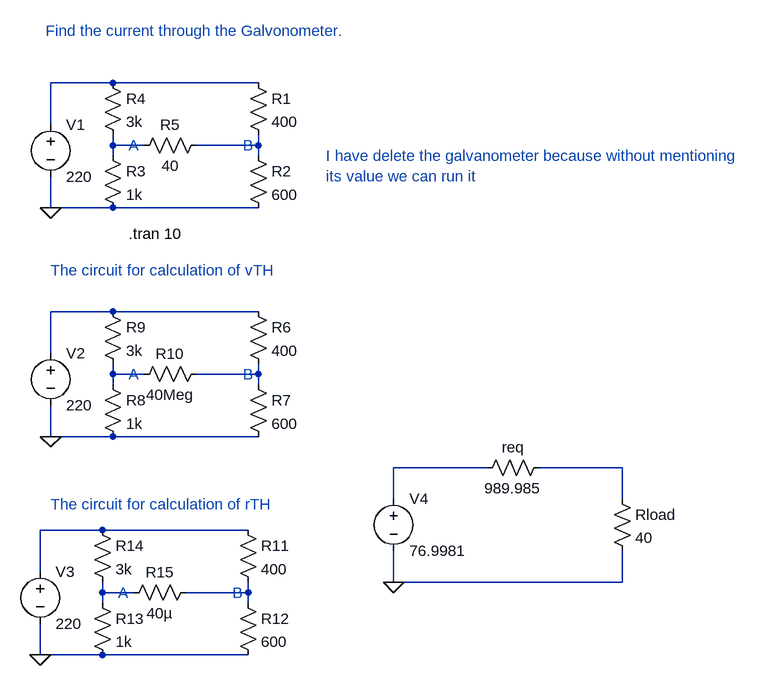
[diagram p0: schematic Lab2_ques2.asc]
Lab2_ques2.asc, the LTspice schematic file:
Version 4
SHEET 1 1068 1392
WIRE 96 160 0 160
WIRE 320 160 96 160
WIRE 0 224 0 160
WIRE 96 256 96 240
WIRE 144 256 96 256
WIRE 320 256 320 240
WIRE 320 256 224 256
WIRE 96 272 96 256
WIRE 320 272 320 256
WIRE 0 352 0 304
WIRE 96 352 0 352
WIRE 320 352 96 352
WIRE 96 512 0 512
WIRE 320 512 96 512
WIRE 0 576 0 512
WIRE 96 608 96 592
WIRE 144 608 96 608
WIRE 320 608 320 592
WIRE 320 608 224 608
WIRE 96 624 96 608
WIRE 320 624 320 608
WIRE 0 704 0 656
WIRE 96 704 0 704
WIRE 320 704 96 704
WIRE 672 752 528 752
WIRE 880 752 752 752
WIRE 528 800 528 752
WIRE 880 800 880 752
WIRE 80 848 -16 848
WIRE 304 848 80 848
WIRE -16 912 -16 848
WIRE 528 928 528 880
WIRE 880 928 880 880
WIRE 880 928 528 928
WIRE 80 944 80 928
WIRE 128 944 80 944
WIRE 304 944 304 928
WIRE 304 944 208 944
WIRE 80 960 80 944
WIRE 304 960 304 944
WIRE -16 1040 -16 992
WIRE 80 1040 -16 1040
WIRE 304 1040 80 1040
FLAG 0 352 0
FLAG 0 704 0
FLAG -16 1040 0
FLAG 528 928 0
SYMBOL Res 304 144 R0
SYMATTR InstName R1
SYMATTR Value 400
SYMBOL Res 304 256 R0
SYMATTR InstName R2
SYMATTR Value 600
SYMBOL Res 80 256 R0
SYMATTR InstName R3
SYMATTR Value 1k
SYMBOL Res 80 144 R0
SYMATTR InstName R4
SYMATTR Value 3k
SYMBOL Voltage 0 208 R0
SYMATTR InstName V1
SYMATTR Value 220
SYMBOL Res 240 240 R90
WINDOW 0 0 56 VBottom 2
WINDOW 3 32 56 VTop 2
SYMATTR InstName R5
SYMATTR Value 40
SYMBOL Res 304 496 R0
SYMATTR InstName R6
SYMATTR Value 400
SYMBOL Res 304 608 R0
SYMATTR InstName R7
SYMATTR Value 600
SYMBOL Res 80 608 R0
SYMATTR InstName R8
SYMATTR Value 1k
SYMBOL Res 80 496 R0
SYMATTR InstName R9
SYMATTR Value 3k
SYMBOL Voltage 0 560 R0
SYMATTR InstName V2
SYMATTR Value 220
SYMBOL Res 240 592 R90
WINDOW 0 0 56 VBottom 2
WINDOW 3 32 56 VTop 2
SYMATTR InstName R10
SYMATTR Value 40Meg
SYMBOL Res 288 832 R0
SYMATTR InstName R11
SYMATTR Value 400
SYMBOL Res 288 944 R0
SYMATTR InstName R12
SYMATTR Value 600
SYMBOL Res 64 944 R0
SYMATTR InstName R13
SYMATTR Value 1k
SYMBOL Res 64 832 R0
SYMATTR InstName R14
SYMATTR Value 3k
SYMBOL Voltage -16 896 R0
SYMATTR InstName V3
SYMATTR Value 220
SYMBOL Res 224 928 R90
WINDOW 0 0 56 VBottom 2
WINDOW 3 32 56 VTop 2
SYMATTR InstName R15
SYMATTR Value 40µ
SYMBOL Res 864 784 R0
SYMATTR InstName Rload
SYMATTR Value 40
SYMBOL Res 768 736 R90
WINDOW 0 0 56 VBottom 2
WINDOW 3 32 56 VTop 2
SYMATTR InstName req
SYMATTR Value 989.985
SYMBOL Voltage 528 784 R0
SYMATTR InstName V4
SYMATTR Value 76.9981
TEXT -8 80 Left 2 ;Find the current through the Galvonometer.
TEXT 120 256 Left 2 ;A
TEXT 296 256 Left 2 ;B
TEXT 120 608 Left 2 ;A
TEXT 296 608 Left 2 ;B
TEXT 0 448 Left 2 ;The circuit for calculation of vTH
TEXT 120 392 Left 2 !.tran 10
TEXT 424 272 Left 2 ;I have delete the galvanometer because without mentioning\nits value we can run it
TEXT 104 944 Left 2 ;A
TEXT 280 944 Left 2 ;B
TEXT 0 808 Left 2 ;The circuit for calculation of rTH

The netlist it stands for:
* Lab2_ques2.asc
R1 N001 N003 400
R2 N003 0 600
R3 N002 0 1k
R4 N001 N002 3k
V1 N001 0 220
R5 N003 N002 40
R6 N004 N006 400
R7 N006 0 600
R8 N005 0 1k
R9 N004 N005 3k
V2 N004 0 220
R10 N006 N005 40Meg
R11 N009 N011 400
R12 N011 0 600
R13 N010 0 1k
R14 N009 N010 3k
V3 N009 0 220
R15 N011 N010 40µ
Rload N008 0 40
req N008 N007 989.985
V4 N007 0 76.9981
* Find the current through the Galvonometer.
* A
* B
* A
* B
* The circuit for calculation of vTH
.tran 10
* I have delete the galvanometer because without mentioning
* its value we can run it
* A
* B
* The circuit for calculation of rTH
.backanno
.end